# EAGLE design JSerial2g (EAGLE 6.6.0)
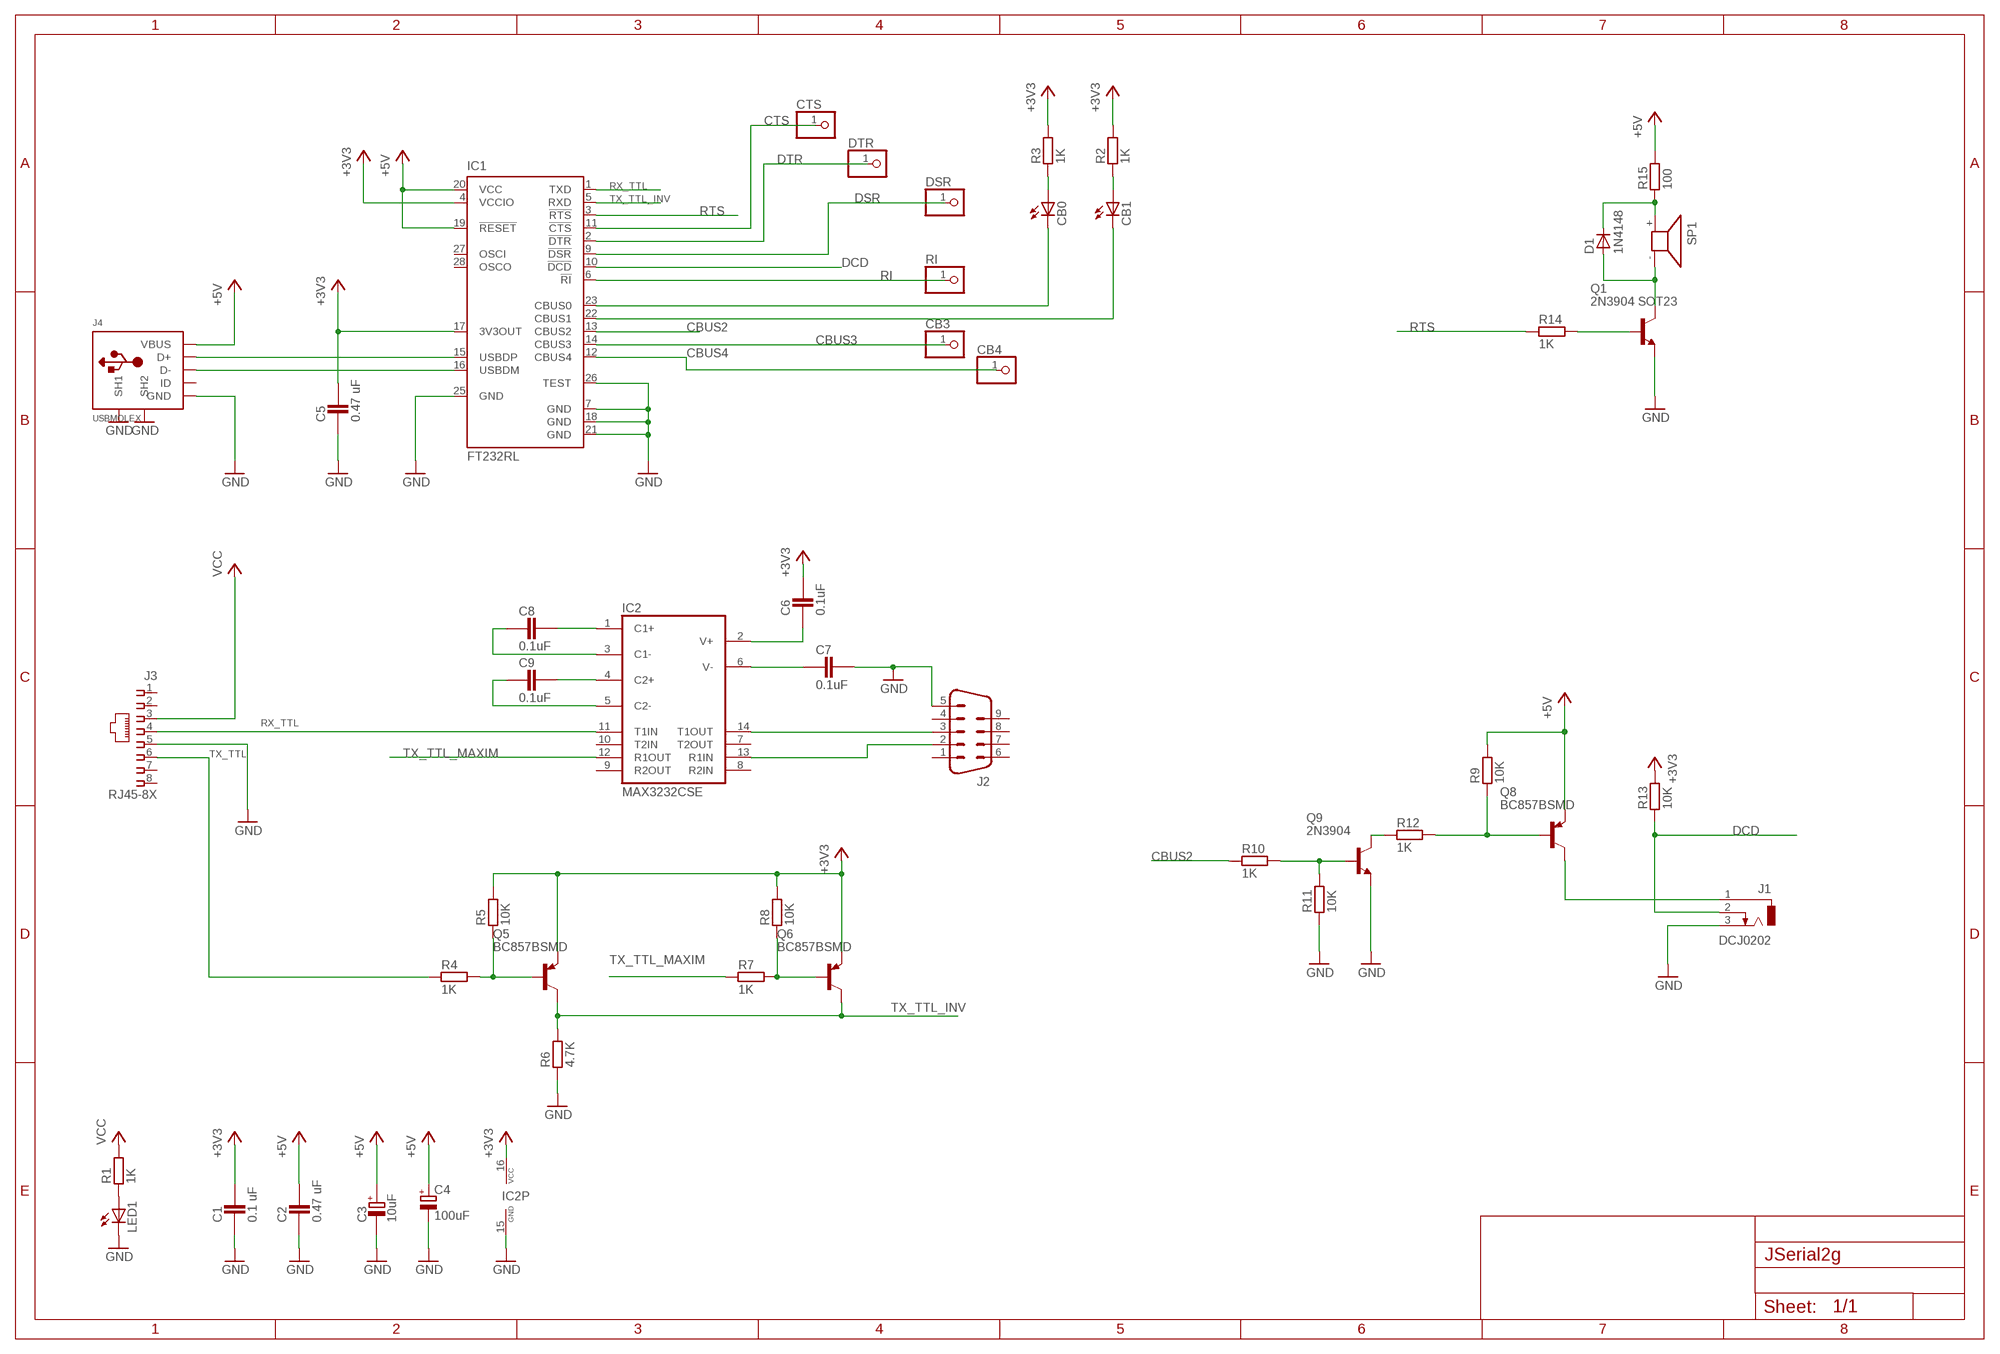
[diagram p0: schematic, sheet 1]

## Parts
C1  0.1 uF  CAPACITOR_0805  [CAPC2012X145AN]
C2  0.47 uF  CAPACITOR_0805  [CAPC2012X145AN]
C3  10uF  POLARISED_A_CASE  [CAPMP3216X180N]
C4  100uF  CPOL-EUE2.5-6  [E2,5-6]
C5  0.47 uF  CAPACITOR_0805  [CAPC2012X145AN]
C6  0.1uF  CAPACITOR_0805  [CAPC2012X145AN]
C7  0.1uF  CAPACITOR_0805  [CAPC2012X145AN]
C8  0.1uF  CAPACITOR_0805  [CAPC2012X145AN]
C9  0.1uF  CAPACITOR_0805  [CAPC2012X145AN]
CB0  LED3MM  [LED3MM]
CB1  LED3MM  [LED3MM]
CB3  PINHD-1X1  [1X01]
CB4  PINHD-1X1  [1X01]
CTS  PINHD-1X1  [1X01]
D1  1N4148  DIODE_SOD-123  [SOD3718X135N]
DSR  PINHD-1X1  [1X01]
DTR  PINHD-1X1  [1X01]
IC1  FT232RL  [SSOP28]
IC2  MAX3232CSE  [SO16]
J1  DCJ0202  [DCJ0202]
J2  M09D  [M09D]
J3  RJ45-8X  [RJ45-NO-SHIELD]
J4  USBMOLEX  [HW-MU-5F-20]
LED1  LED3MM  [LED3MM]
Q1  2N3904 SOT23  NPN_SOT-23  [SOT95P280X135-3N]
Q5  BC857BSMD  [SOT23-BEC]
Q6  BC857BSMD  [SOT23-BEC]
Q8  BC857BSMD  [SOT23-BEC]
Q9  2N3904  NPN_SOT-23  [SOT95P280X135-3N]
R1  1K  RESISTOR_0805  [RESC2012X70N]
R2  1K  RESISTOR_0805  [RESC2012X70N]
R3  1K  RESISTOR_0805  [RESC2012X70N]
R4  1K  RESISTOR_0805  [RESC2012X70N]
R5  10K  RESISTOR_0805  [RESC2012X70N]
R6  4.7K  RESISTOR_0805  [RESC2012X70N]
R7  1K  RESISTOR_0805  [RESC2012X70N]
R8  10K  RESISTOR_0805  [RESC2012X70N]
R9  10K  RESISTOR_0805  [RESC2012X70N]
R10  1K  RESISTOR_0805  [RESC2012X70N]
R11  10K  RESISTOR_0805  [RESC2012X70N]
R12  1K  RESISTOR_0805  [RESC2012X70N]
R13  10K  RESISTOR_0805  [RESC2012X70N]
R14  1K  RESISTOR_0805  [RESC2012X70N]
R15  100  RESISTOR_0805  [RESC2012X70N]
RI  PINHD-1X1  [1X01]
SP1  KSS1201  [KSS1201]

## Nets
+3V3: C1.2 C5.2 C6.2 IC1.4(VCCIO) IC1.17(3V3OUT) IC2.16(VCC) Q5.E Q6.E R2.2 R3.2 R5.2 R8.2 R13.2
+5V [power]: C2.2 C3.+ C4.+ IC1.19(!RESET) IC1.20(VCC) J4.VBUS Q8.E R9.2 R15.2
CBUS0: CB0.K(C) IC1.23(CBUS0)
CBUS1: CB1.K(C) IC1.22(CBUS1)
CBUS2: IC1.13(CBUS2) R10.1
CBUS3: CB3.1 IC1.14(CBUS3)
CBUS4: CB4.1 IC1.12(CBUS4)
CTS [power]: CTS.1 IC1.11(!CTS)
DCD [power]: IC1.10(!DCD) J1.2 R13.1
DSR [power]: DSR.1 IC1.9(!DSR)
DTR: DTR.1 IC1.2(!DTR)
GND [power]: C1.1 C2.1 C3.- C4.- C5.1 C7.2 IC1.7(GND) IC1.18(GND) IC1.21(GND) IC1.25(GND) IC1.26(TEST) IC2.15(GND) J1.3 J2.5 J3.5 J4.GND J4.SH1 J4.SH2 LED1.K(C) Q1.2(E) Q9.2(E) R6.1 R11.1
N$1: LED1.A R1.1
N$2: C8.1 IC2.3(C1-)
N$3: IC1.15(USBDP) J4.D+
N$4: IC1.16(USBDM) J4.D-
N$5: CB1.A R2.1
N$6: CB0.A R3.1
N$7: C8.2 IC2.1(C1+)
N$8: C9.1 IC2.5(C2-)
N$9: C9.2 IC2.4(C2+)
N$10: C6.1 IC2.2(V+)
N$11: C7.1 IC2.6(V-)
N$12: IC2.14(T1OUT) J2.3
N$13: IC2.13(R1IN) J2.2
N$14: J1.1 Q8.C
N$15: Q5.B R4.2 R5.1
N$16: Q6.B R7.2 R8.1
N$17: Q9.1(B) R10.2 R11.2
N$18: Q9.3(C) R12.1
N$19: Q8.B R9.1 R12.2
N$20: Q1.1(B) R14.2
N$21: D1.A Q1.3(C) SP1.-
N$22: D1.K R15.1 SP1.+
RI: IC1.6(!RI) RI.1
RTS: IC1.3(!RTS) R14.1
RX_TTL: IC1.1(TXD) IC2.11(T1IN) J3.4
TX_TTL: J3.6 R4.1
TX_TTL_INV: IC1.5(RXD) Q5.C Q6.C R6.2
TX_TTL_MAXIM: IC2.12(R1OUT) R7.1
VCC [power]: J3.3 R1.2
Unconnected: IC1.27(OSCI) IC1.28(OSCO) IC2.7(T2OUT) IC2.8(R2IN) IC2.9(R2OUT) IC2.10(T2IN) J2.1 J2.4 J2.6 J2.7 J2.8 J2.9 J3.1 J3.2 J3.7 J3.8 J4.ID

## Library data of the parts
C1 C2 C5-C9 = ipc-7351-capacitor:CAPACITOR_
C3 = ipc-7351-capacitor:POLARISED_
C4 = rcl:CPOL-EU: POLARIZED CAPACITOR, European symbol
CB0 CB1 LED1 = jlab:LED: LED OSRAM: - CHIPLED LG R971, LG N971, LY N971, LG Q971, LY Q971, LO R971, LY R971 LH N974, LH R974 LS Q976, LO Q976, LY Q976 LO Q996 - Hyper CHIPLED LW Q18S LB Q993, LB Q99A, LB R99A - SideLED LS A670, LO A670, LY A670, LG A670, LP A670 LB A673, LV A673, LT A673, LW A673 LH A674 LY A675 LS A676, LA A676, LO A676, LY A676, LW A676 LS A679, LY A679, LG A679 - Hyper Micro SIDELED® LS Y876, LA Y876, LO Y876, LY Y876 LT Y87S - SmartLED LW L88C, LW L88S LB L89C, LB L89S, LG L890 LS L89K, LO L89K, LY L89K LS L896, LA L896, LO L896, LY L896 - TOPLED LS T670, LO T670, LY T670, LG T670, LP T670 LSG T670, LSP T670, LSY T670, LOP T670, LYG T670 LG T671, LOG T671, LSG T671 LB T673, LV T673, LT T673, LW T673 LH T674 LS T676, LA T676, LO T676, LY T676, LB T676, LH T676, LSB T676, LW T676 LB T67C, LV T67C, LT T67C, LS T67K, LO T67K, LY T67K, LW E67C LS E67B, LA E67B, LO E67B, LY E67B, LB E67C, LV E67C, LT E67C LW T67C LS T679, LY T679, LG T679 LS T770, LO T770, LY T770, LG T770, LP T770 LB T773, LV T773, LT T773, LW T773 LH T774 LS E675, LA E675, LY E675, LS T675 LS T776, LA T776, LO T776, LY T776, LB T776 LHGB T686 LT T68C, LB T68C - Hyper Mini TOPLED® LB M676 - Mini TOPLED Santana® LG M470 LS M47K, LO M47K, LY M47K Source: http://www.osram.convergy.de LUXEON: - LUMILED® LXK2-PW12-R00, LXK2-PW12-S00, LXK2-PW14-U00, LXK2-PW14-V00 LXK2-PM12-R00, LXK2-PM12-S00, LXK2-PM14-U00 LXK2-PE12-Q00, LXK2-PE12-R00, LXK2-PE12-S00, LXK2-PE14-T00, LXK2-PE14-U00 LXK2-PB12-K00, LXK2-PB12-L00, LXK2-PB12-M00, LXK2-PB14-N00, LXK2-PB14-P00, LXK2-PB14-Q00 LXK2-PR12-L00, LXK2-PR12-M00, LXK2-PR14-Q00, LXK2-PR14-R00 LXK2-PD12-Q00, LXK2-PD12-R00, LXK2-PD12-S00 LXK2-PH12-R00, LXK2-PH12-S00 LXK2-PL12-P00, LXK2-PL12-Q00, LXK2-PL12-R00 Source: www.luxeon.com KINGBRIGHT: KA-3528ASYC Source: www.kingbright.com
CB3 CB4 CTS DSR DTR RI = pinhead:PINHD-1X1: PIN HEADER
D1 = ipc-7351-diode:DIODE_
IC1 = ftdichip:FT232R: Source: http://www.ftdichip.com/Documents/DataSheets/DS_FT232R_v104.pdf; MPN: FT232RL; OC_FARNELL: 1146032; OC_NEWARK: 91K9918
IC2 = maxim:MAX3232*: True RS-232 Transceivers 3.0V to 5.5V, Low-Power up to 1Mbps, Using Four 0.1µF External Capacitors Source: http://pdfserv.maxim-ic.com/en/ds/MAX3222-MAX3241.pdf; MPN: MAX3232CSE; OC_FARNELL: 9725490; OC_NEWARK: 90C2890
J1 = con-jack:DCJ0202: DC POWER JACK Source: DCJ0202.pdf; OC_FARNELL: unknown; OC_NEWARK: unknown
J2 = jlab:M09: SUB-D; OC_FARNELL: unknown; OC_NEWARK: unknown
J3 = jlab:RJ45: CORCOM Modular RJ Jacks No Shield Source: www.tycoelectronics.com .. ENG_DS_1654001_1099_RJ_L_0507.pdf; MPN: RJ45-8X; OC_FARNELL: unknown; OC_NEWARK: 16R6101
J4 = jlab_connectors:USB: USB Connectors USBMINIB - Surface Mount Female Mini-B USB Connector 4UConnector: 06564 By microbuilder.eu Thru-hole RA Female Mini-B USB Connector 4UConnector: 18732 By ladyada.net
Q1 Q9 = ipc-7351-transistor:NPN_
Q5 Q6 Q8 = transistor-pnp:BC857*: PNP Transistror
R1-R15 = ipc-7351-resistor:RESISTOR_
SP1 = buzzer:KSS1201: SPEAKER Source: Schukat; OC_FARNELL: unknown; OC_NEWARK: unknown

## Net classes
0 default: width 0.254 mm, clearance 0.152 mm
1 power: width 0.254 mm, clearance 0.152 mm

## Board
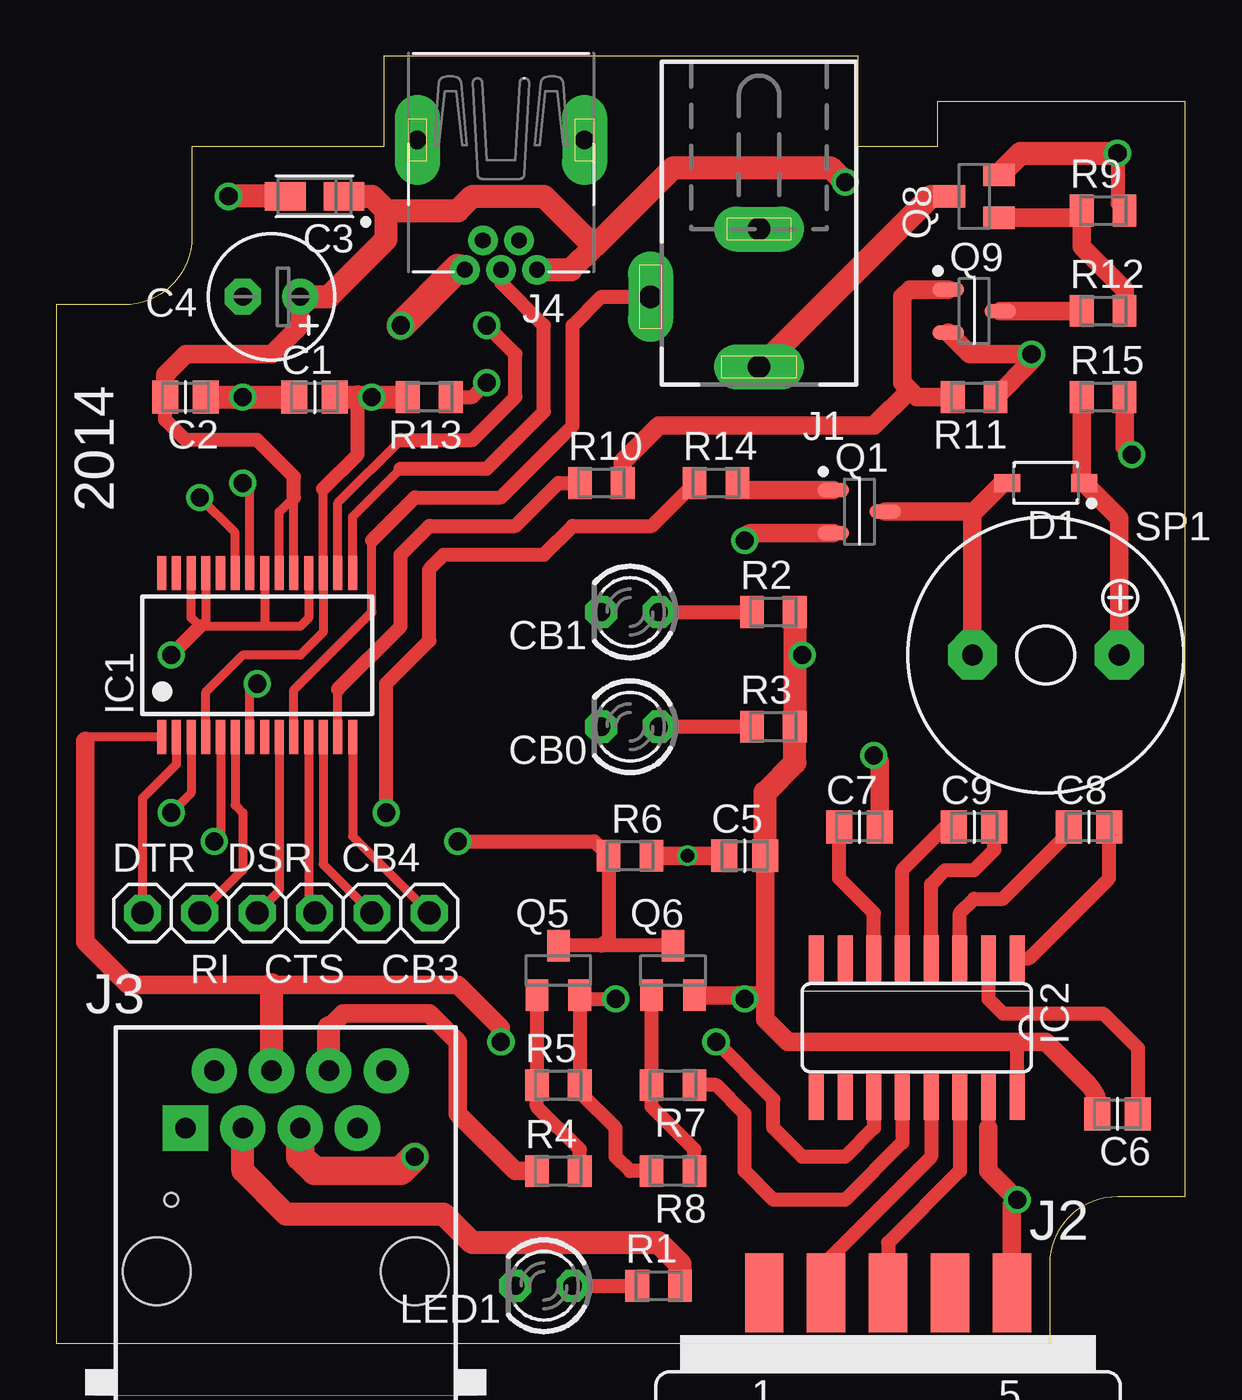
[diagram p1: board, top side]
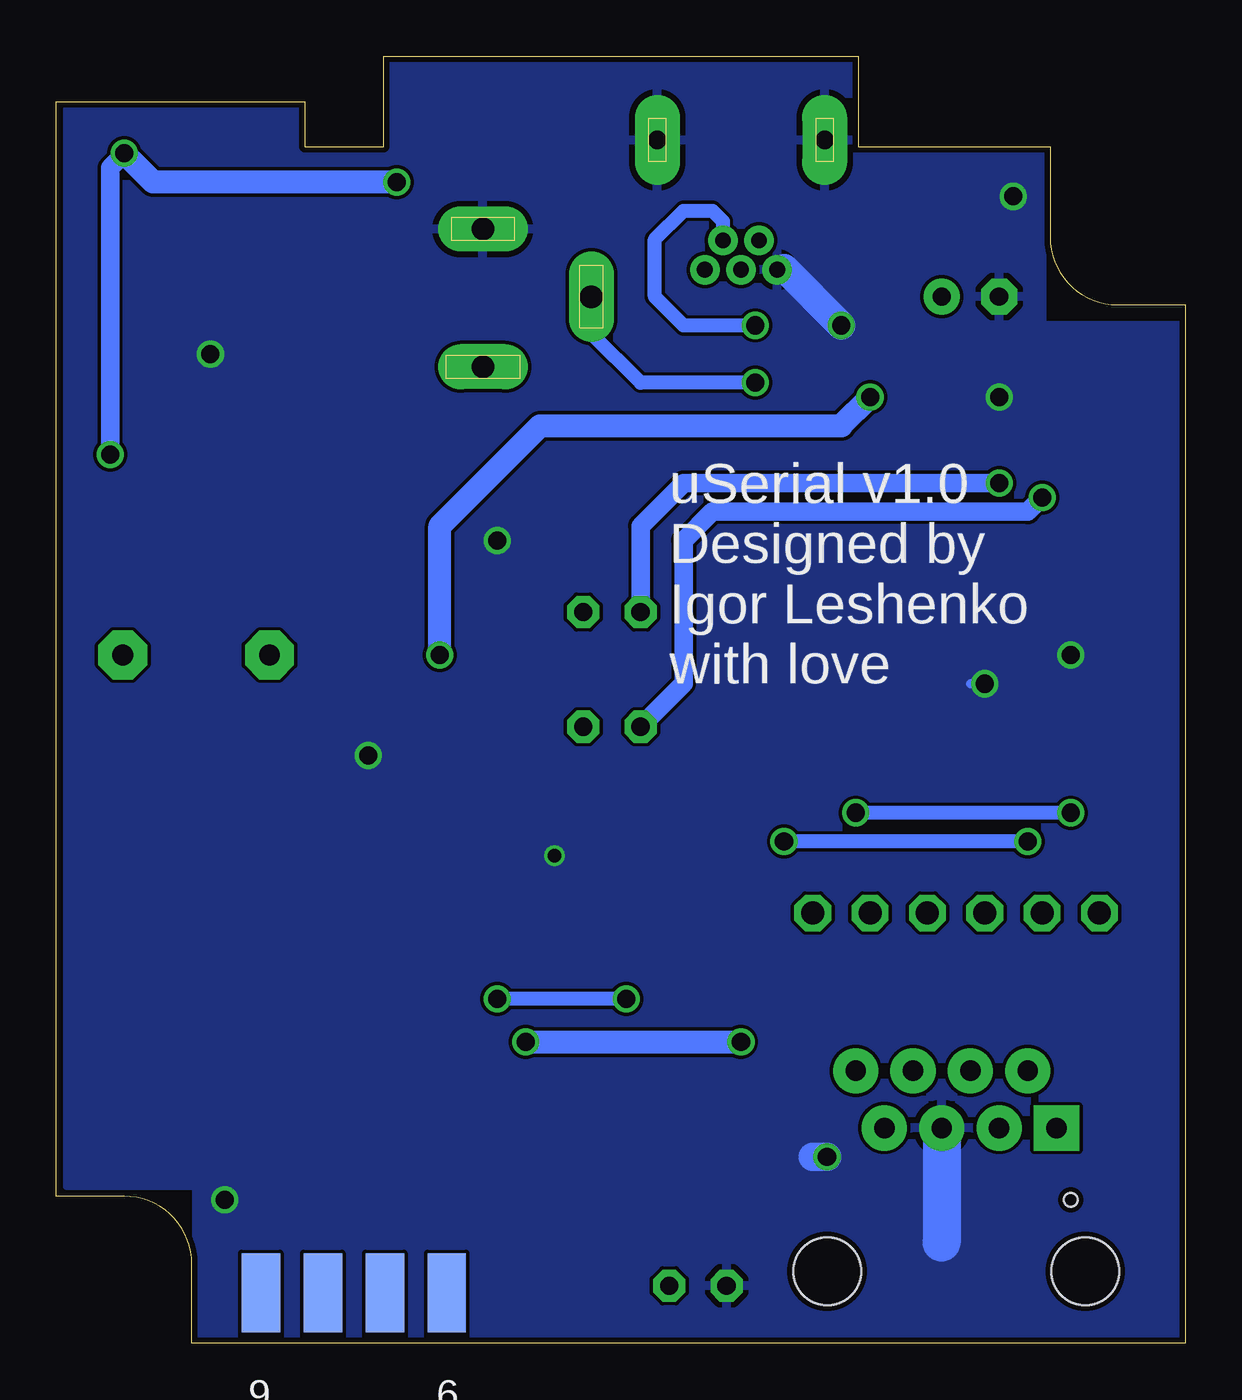
[diagram p2: board, bottom side, seen from below]

Size 50 x 57 mm. Coordinates in mm from the lower left corner, seen from the top.
Outline: 0,0 44,0 44,3.5 arc-90 47,6.5 50,6.5 50,55 39,55 39,53 35.5,53 35.5,57 14.5,57 14.5,53 6,53 6,49 arc-90 3,46 0,46 0,0
Copper layers (1*16): Top 0.035mm / dielectric 1.5mm / Bottom 0.035mm
Design rules "JSerial2g": minimum track width 10mil, minimum drill 0.6mm, track to track 6mil, track to pad 6mil, pad to pad 6mil, via to via 6mil, smd to smd 0mil, copper to edge 10mil, drill to drill 10mil, minimum pad ring 12mil, minimum via ring 6mil, stop-mask expansion 2mil, vias tented up to drill 40mil, thermal gap 10mil
Holes 0.6 mm at 5.08,6.35

### Footprints (pad centres in the part's own frame; a part is rotated, then mirrored left to right if it is on the bottom)
CAPC2012X145AN = smd 1.15 x 1.45: 1 -0.9,0; 2 0.9,0
CAPMP3216X180N = smd 1.8 x 1.25: + -1.3,0; - 1.3,0
E2,5-6 = drill 0.813 pad 1.6: + -1.27,0 | drill 0.813 pad 1.6 octagon: - 1.27,0
LED3MM = drill 0.813 octagon: A -1.27,0; K 1.27,0
1X01 = drill 1.016 octagon: 1 0,0
SOD3718X135N = smd 1.15 x 0.8: A 1.7,0; K -1.7,0
SSOP28 = smd 0.4 x 1.5: 1 -4.225,-3.625; 2 -3.575,-3.625; 3 -2.925,-3.625; 4 -2.275,-3.625; 5 -1.625,-3.625; 6 -0.975,-3.625; 7 -0.325,-3.625; 8 0.325,-3.625; 9 0.975,-3.625; 10 1.625,-3.625; 11 2.275,-3.625; 12 2.925,-3.625; 13 3.575,-3.625; 14 4.225,-3.625; 15 4.225,3.625; 16 3.575,3.625; 17 2.925,3.625; 18 2.275,3.625; 19 1.625,3.625; 20 0.975,3.625; 21 0.325,3.625; 22 -0.325,3.625; 23 -0.975,3.625; 24 -1.625,3.625; 25 -2.275,3.625; 26 -2.925,3.625; 27 -3.575,3.625; 28 -4.225,3.625
SO16 = smd 0.66 x 2.032: 1 -4.445,-3.073; 2 -3.175,-3.073; 3 -1.905,-3.073; 4 -0.635,-3.073; 5 0.635,-3.073; 6 1.905,-3.073; 7 3.175,-3.073; 8 4.445,-3.073; 9 4.445,3.073; 10 3.175,3.073; 11 1.905,3.073; 12 0.635,3.073; 13 -0.635,3.073; 14 -1.905,3.073; 15 -3.175,3.073; 16 -4.445,3.073
DCJ0202 = drill 1 pad 2 long: 1 0,3.1; 2 4.8,0; 3 0,-3
M09D = smd 1.7 x 3.5: 1 5.486,-6.045; 2 2.743,-6.045; 3 0,-6.045; 4 -2.743,-6.045; 5 -5.486,-6.045 | smd 1.7 x 3.5 bottom: 6 4.115,-6.045; 7 1.372,-6.045; 8 -1.372,-6.045; 9 -4.115,-6.045
RJ45-NO-SHIELD = drill 0.9 pad 2 square: 1 -4.445,6.35 | drill 0.9 pad 2: 2 -3.175,8.89; 3 -1.905,6.35; 4 -0.635,8.89; 5 0.635,6.35; 6 1.905,8.89; 7 3.175,6.35; 8 4.445,8.89 | hole 3: -5.715,0; 5.715,0
HW-MU-5F-20 = drill 0.7: D+ 0,9.6; D- -0.8,8.3; GND 1.6,9.6; ID 0.8,8.3; VBUS -1.6,9.6 | drill 0.8 pad 2 long: SH1 -3.7,3.85; SH2 3.7,3.85
SOT95P280X135-3N = smd 1.4 x 0.65: 1 -1.15,0.95; 2 -1.15,-0.95; 3 1.15,0
SOT23-BEC = smd 1 x 1.4: B -0.95,-1.1; C 0,1.1; E 0.95,-1.1
RESC2012X70N = smd 1.05 x 1.4: 1 -0.95,0; 2 0.95,0
KSS1201 = drill 0.914 pad 2.159 octagon: + 3.251,0; - -3.251,0

### Placement (x,y rotation side)
C1  11.43,41.91 0 top
C2  5.71,41.91 180 top
C3  11.43,50.8 180 top
C4  9.53,46.35 180 top
C5  30.48,21.59 0 top
C6  46.99,10.16 180 top
C7  35.56,22.86 0 top
C8  45.72,22.86 0 top
C9  40.64,22.86 0 top
CB0  25.4,27.3 180 top
CB1  25.4,32.38 180 top
CB3  16.51,19.05 180 top
CB4  13.97,19.05 0 top
CTS  11.43,19.05 180 top
D1  43.81,38.1 180 top
DSR  8.89,19.05 0 top
DTR  3.81,19.05 0 top
IC1  8.89,30.48 0 top
IC2  38.1,13.97 180 top
J1  31.11,46.35 180 top
J2  36.83,-3.81 180 top
J3  10.16,3.17 0 top
J4  19.68,57.15 180 top
LED1  21.59,2.54 180 top
Q1  35.56,36.83 0 top
Q5  22.23,16.51 0 top
Q6  27.3,16.51 0 top
Q8  40.64,50.8 90 top
Q9  40.64,45.72 0 top
R1  26.67,2.54 0 top
R2  31.75,32.38 0 top
R3  31.75,27.3 0 top
R4  22.23,7.62 0 top
R5  22.23,11.43 0 top
R6  25.4,21.59 180 top
R7  27.3,11.43 180 top
R8  27.3,7.62 180 top
R9  46.35,50.16 0 top
R10  24.13,38.1 0 top
R11  40.64,41.91 180 top
R12  46.35,45.72 0 top
R13  16.51,41.91 180 top
R14  29.21,38.1 0 top
R15  46.35,41.91 0 top
RI  6.35,19.05 180 top
SP1  43.81,30.48 0 top

### Tracks (layer width: path | path; a pad name or v marks a point on that pad's centre or on a via)
+3V3  (via drill 0.8)
  Top 0.406: IC1.4 6.62,28.84 8.26,30.48 10.79,30.48 11.81,31.5 IC1.17 11.81,37.85
  Top 0.61: R8.2 25.4,7.62 24.77,8.26 24.77,9.53 23.18,11.12 R5.2 Q5.E 23.34,15.24 v24.77,15.24 | IC2.16 42.55,13.34 | v30.48,15.24 30.48,15.41 | 11.81,37.85 13.34,39.37 13.34,41.91
  Top 0.813: C5.2 31.38,15.41 | 31.38,15.41 31.38,14.34 32.38,13.34 42.55,13.34 43.81,13.34 45.72,11.43 arc-58 C6.2 | Q6.E 30.48,15.41 31.38,15.41
  Top 1.016: C5.2 31.38,24.39 32.7,25.71 R3.2 R2.2 32.7,30.48 v33.02,30.48 | C1.2 13.34,41.91 v13.97,41.91 R13.2
  Bottom 0.61: v24.77,15.24 30.31,15.24 30.39,15.32 | 30.39,15.32 30.48,15.41 | v30.48,15.24 30.48,15.32 30.39,15.32
  Bottom 1.016: v33.02,30.48 33.02,36.2 28.57,40.64 15.24,40.64 v13.97,41.91
+5V  (via drill 0.8)
  Top 0.406: IC1.19 10.52,37.47 9.87,36.81 IC1.20
  Top 0.61: v46.99,52.7 46.99,50.48 R9.2 | 10.52,37.47 10.52,38.38 8.89,40.01 5.71,40.01 4.82,40.91 C2.2
  Top 0.813: R15.2 47.3,39.69 v47.62,39.37 | C4.+ 10.79,45.09 9.53,43.81 5.71,43.81 4.82,42.91 C2.2
  Top 1.016: Q8.E 42.7,52.7 v46.99,52.7 | J4.VBUS 22.79,47.55 23.81,48.58 | 23.81,48.58 27.3,52.07 34.29,52.07 v34.92,51.44 | C3.+ 13.97,50.8 14.61,50.16 | 14.61,50.16 17.78,50.16 18.41,50.8 21.59,50.8 23.81,48.58 | C4.+ 12.06,46.35 14.61,48.9 14.61,50.16
  Bottom 0.813: v47.62,39.37 47.62,52.07 v46.99,52.7
  Bottom 1.016: v34.92,51.44 45.72,51.44 v46.99,52.7
CBUS0  (via drill 0.8)
  Top 0.406: IC1.23 7.92,35.9 v6.35,37.47
  Bottom 0.813: v6.35,37.47 6.99,36.83 20.95,36.83 22.23,35.56 22.23,29.21 CB0.K
CBUS1  (via drill 0.8)
  Top 0.406: IC1.22 8.56,37.79 v8.26,38.1
  Bottom 0.813: v8.26,38.1 22.23,38.1 24.13,36.2 CB1.K
CBUS2
  Top 0.406: IC1.13 12.46,28.98
  Top 0.61: 12.46,28.98 15.24,31.75 15.24,34.92 16.51,36.2 20.32,36.2 22.23,38.1 R10.1
CBUS3
  Top 0.406: IC1.14 13.12,22.45 CB3.1
CBUS4
  Top 0.406: IC1.12 11.81,21.2 CB4.1
CTS
  Top 0.406: IC1.11 11.16,19.32 CTS.1
DCD  (via drill 0.8)
  Top 0.406: IC1.10 10.52,28.93 13.97,32.38 13.97,35.56
  Top 0.61: R13.1 18.41,41.91 v19.05,42.55 | 13.97,35.56 15.88,37.47 19.68,37.47 22.86,40.64 22.86,45.09 24.13,46.35 J1.2
  Bottom 0.61: v19.05,42.55 24.13,42.55 26.32,44.73 J1.2
DSR
  Top 0.406: IC1.9 9.87,20.02 DSR.1
DTR
  Top 0.406: IC1.2 5.32,25.64 3.81,24.13 DTR.1
GND  (via drill 0.6, 0.8)
  Top 0.406: IC1.18 11.16,32.12 10.79,31.75 9.21,31.75 | 9.21,31.75 6.62,31.75 | IC1.26 5.96,32.13 6.35,31.75 6.62,31.75 | IC1.25 6.62,31.75 | IC1.21 9.21,31.75 | IC1.7 8.56,28.89 v8.89,29.21
  Top 0.61: IC2.15 41.27,9.53 | 43.18,43.5 v43.18,43.81 | v5.08,30.48 6.35,31.75
  Top 0.813: R6.1 v27.94,21.59 C5.1 | Q1.2 30.8,35.88 arc90 v30.48,35.56 | C7.2 36.46,25.77 v36.2,26.04 | J2.5 42.32,6.12 v42.55,6.35 41.27,7.62 41.27,9.53 | R11.1 43.18,43.5 | Q9.2 40.45,43.81 v43.18,43.81
  Top 1.016: C3.- v7.62,50.8 | C1.1 v8.26,41.91 C2.1
  Top 1.27: v15.24,45.09 17.78,47.62 | J3.5 10.79,8.26 11.43,7.62 15.24,7.62 v15.88,8.26
  Bottom 0.406: v8.89,29.21 9.53,29.21
  Bottom 1.27: v15.24,45.09 17.78,47.62 | v15.88,8.26 16.51,8.26
  Bottom 1.676: J3.5 10.79,4.45
  pour Bottom: 0,45.09 6.35,45.09 6.35,53.34 13.97,53.34 13.97,57.15 35.56,57.15 35.56,53.34 39.37,53.34 39.37,54.61 49.53,54.61 49.53,6.99 43.81,6.99 43.81,0 0,0
N$1
  Top 0.61: LED1.A R1.1
N$2
  Top 0.61: IC2.3 40.01,19.05 40.64,19.68 41.91,19.68 44.82,22.59 C8.1
N$3
  Top 0.406: IC1.15 13.12,36.61 15.24,38.73
  Top 0.61: 15.24,38.73 19.05,38.73 21.59,41.27 21.59,45.09 19.68,46.99 J4.D+
N$4  (via drill 0.8)
  Top 0.406: IC1.16 12.46,37.23 15.24,40.01
  Top 0.61: 15.24,40.01 18.41,40.01 20.32,41.91 20.32,43.81 v19.05,45.09
  Bottom 0.61: v19.05,45.09 22.23,45.09 23.5,46.35 23.5,48.9 22.23,50.16 20.95,50.16 20.48,49.7 J4.D-
N$5
  Top 0.61: CB1.A R2.1
N$6
  Top 0.61: CB0.A R3.1
N$7
  Top 0.61: IC2.1 43.08,17.04 46.62,20.59 C8.2
N$8
  Top 0.61: IC2.5 37.47,20.95 39.37,22.86 C9.1
N$9
  Top 0.61: IC2.4 38.73,20.32 39.37,20.95 40.64,20.95 41.54,21.86 C9.2
N$10
  Top 0.61: IC2.2 41.27,15.24 41.91,14.61 46.35,14.61 47.89,13.07 C6.1
N$11
  Top 0.61: IC2.6 36.2,19.05 34.66,20.59 C7.1
N$12
  Top 0.61: IC2.14 40.01,7.62 36.83,4.45 J2.3
N$13
  Top 0.61: IC2.13 38.73,8.26 34.09,3.61 J2.2
N$14
  Top 0.813: J1.1 31.19,43.26
  Top 1.016: 31.19,43.26 38.73,50.8 Q8.C
N$15
  Top 0.61: Q5.B R5.1 21.27,10.47 23.18,8.57 R4.2
N$16
  Top 0.61: R8.1 28.25,8.57 26.36,10.47 R7.2 Q6.B
N$17
  Top 0.813: Q9.1 37.78,46.67 37.47,46.35 37.47,42.55 37.78,42.23 | 37.78,42.23 38.1,41.91 R11.2 | 37.78,42.23 36.2,40.64 26.67,40.64 25.08,39.05 R10.2
N$18
  Top 0.813: Q9.3 R12.1
N$19
  Top 0.61: 45.09,49.85 R9.1
  Top 0.813: R12.2 47.3,46.67 45.41,48.58 R9.1 | Q8.B 45.09,49.85
N$20
  Top 0.813: Q1.1 30.48,37.78 R14.2
N$21
  Top 0.406: 40.56,36.75 40.64,36.83
  Top 0.61: 41.91,38.1 D1.A
  Top 0.813: Q1.3 40.64,36.83 41.91,38.1 | SP1.- 40.56,36.75
N$22
  Top 0.61: 45.41,38.21 D1.K
  Top 0.813: R15.1 45.41,38.21 | SP1.+ 47.07,36.55 D1.K
RI
  Top 0.406: RI.1 8.26,20.95 8.26,23.5 7.92,23.84 IC1.6
RTS  (via drill 0.8)
  Top 0.406: IC1.3 5.96,24.38 v5.08,23.5
  Top 0.61: v14.61,23.5 14.61,29.21 16.51,31.11 16.51,34.29 17.14,34.92 21.59,34.92 22.86,36.2 26.36,36.2 R14.1
  Bottom 0.61: v5.08,23.5 v14.61,23.5
RX_TTL  (via drill 0.8)
  Top 0.406: IC1.1 1.46,26.86 1.27,26.67
  Top 0.61: IC2.11 36.2,9.53 34.92,8.26 33.02,8.26 31.75,9.53 31.75,10.79 v29.21,13.34
  Top 0.813: v19.68,13.34 19.68,13.97 17.78,15.88 9.53,15.88 3.17,15.88 1.27,17.78 1.27,26.67
  Top 1.016: J3.4 9.53,15.88
  Bottom 1.016: v29.21,13.34 v19.68,13.34
TX_TTL
  Top 0.813: 12.06,13.97 12.7,14.61 16.51,14.61 17.78,13.34 17.78,10.16 20.32,7.62 R4.1
  Top 1.016: J3.6 12.06,13.97
TX_TTL_INV  (via drill 0.8)
  Top 0.406: IC1.5 7.26,22.5 v6.99,22.23
  Top 0.61: Q6.C 24.13,17.61 | 24.13,17.61 Q5.C | 24.13,17.61 24.45,17.93 R6.2 23.82,22.23 v17.78,22.23
  Bottom 0.61: v6.99,22.23 v17.78,22.23
TX_TTL_MAXIM
  Top 0.61: IC2.12 37.47,8.89 34.92,6.35 31.75,6.35 30.48,7.62 30.48,10.16 29.21,11.43 R7.1
VCC
  Top 1.016: R1.2 27.62,3.5 26.67,4.45 18.41,4.45 17.14,5.71 10.16,5.71 8.26,7.62 J3.3

### Text on the board
tNames: 2014
bNames: uSerial v1.0 / Designed by / Igor Leshenko / with love